# EasyEDA schematic DarkDetector.json
TITLE: Sheet_1; REV: 1.0; Date: 2025-12-07; Sheet: 1/1; Company: Your Company
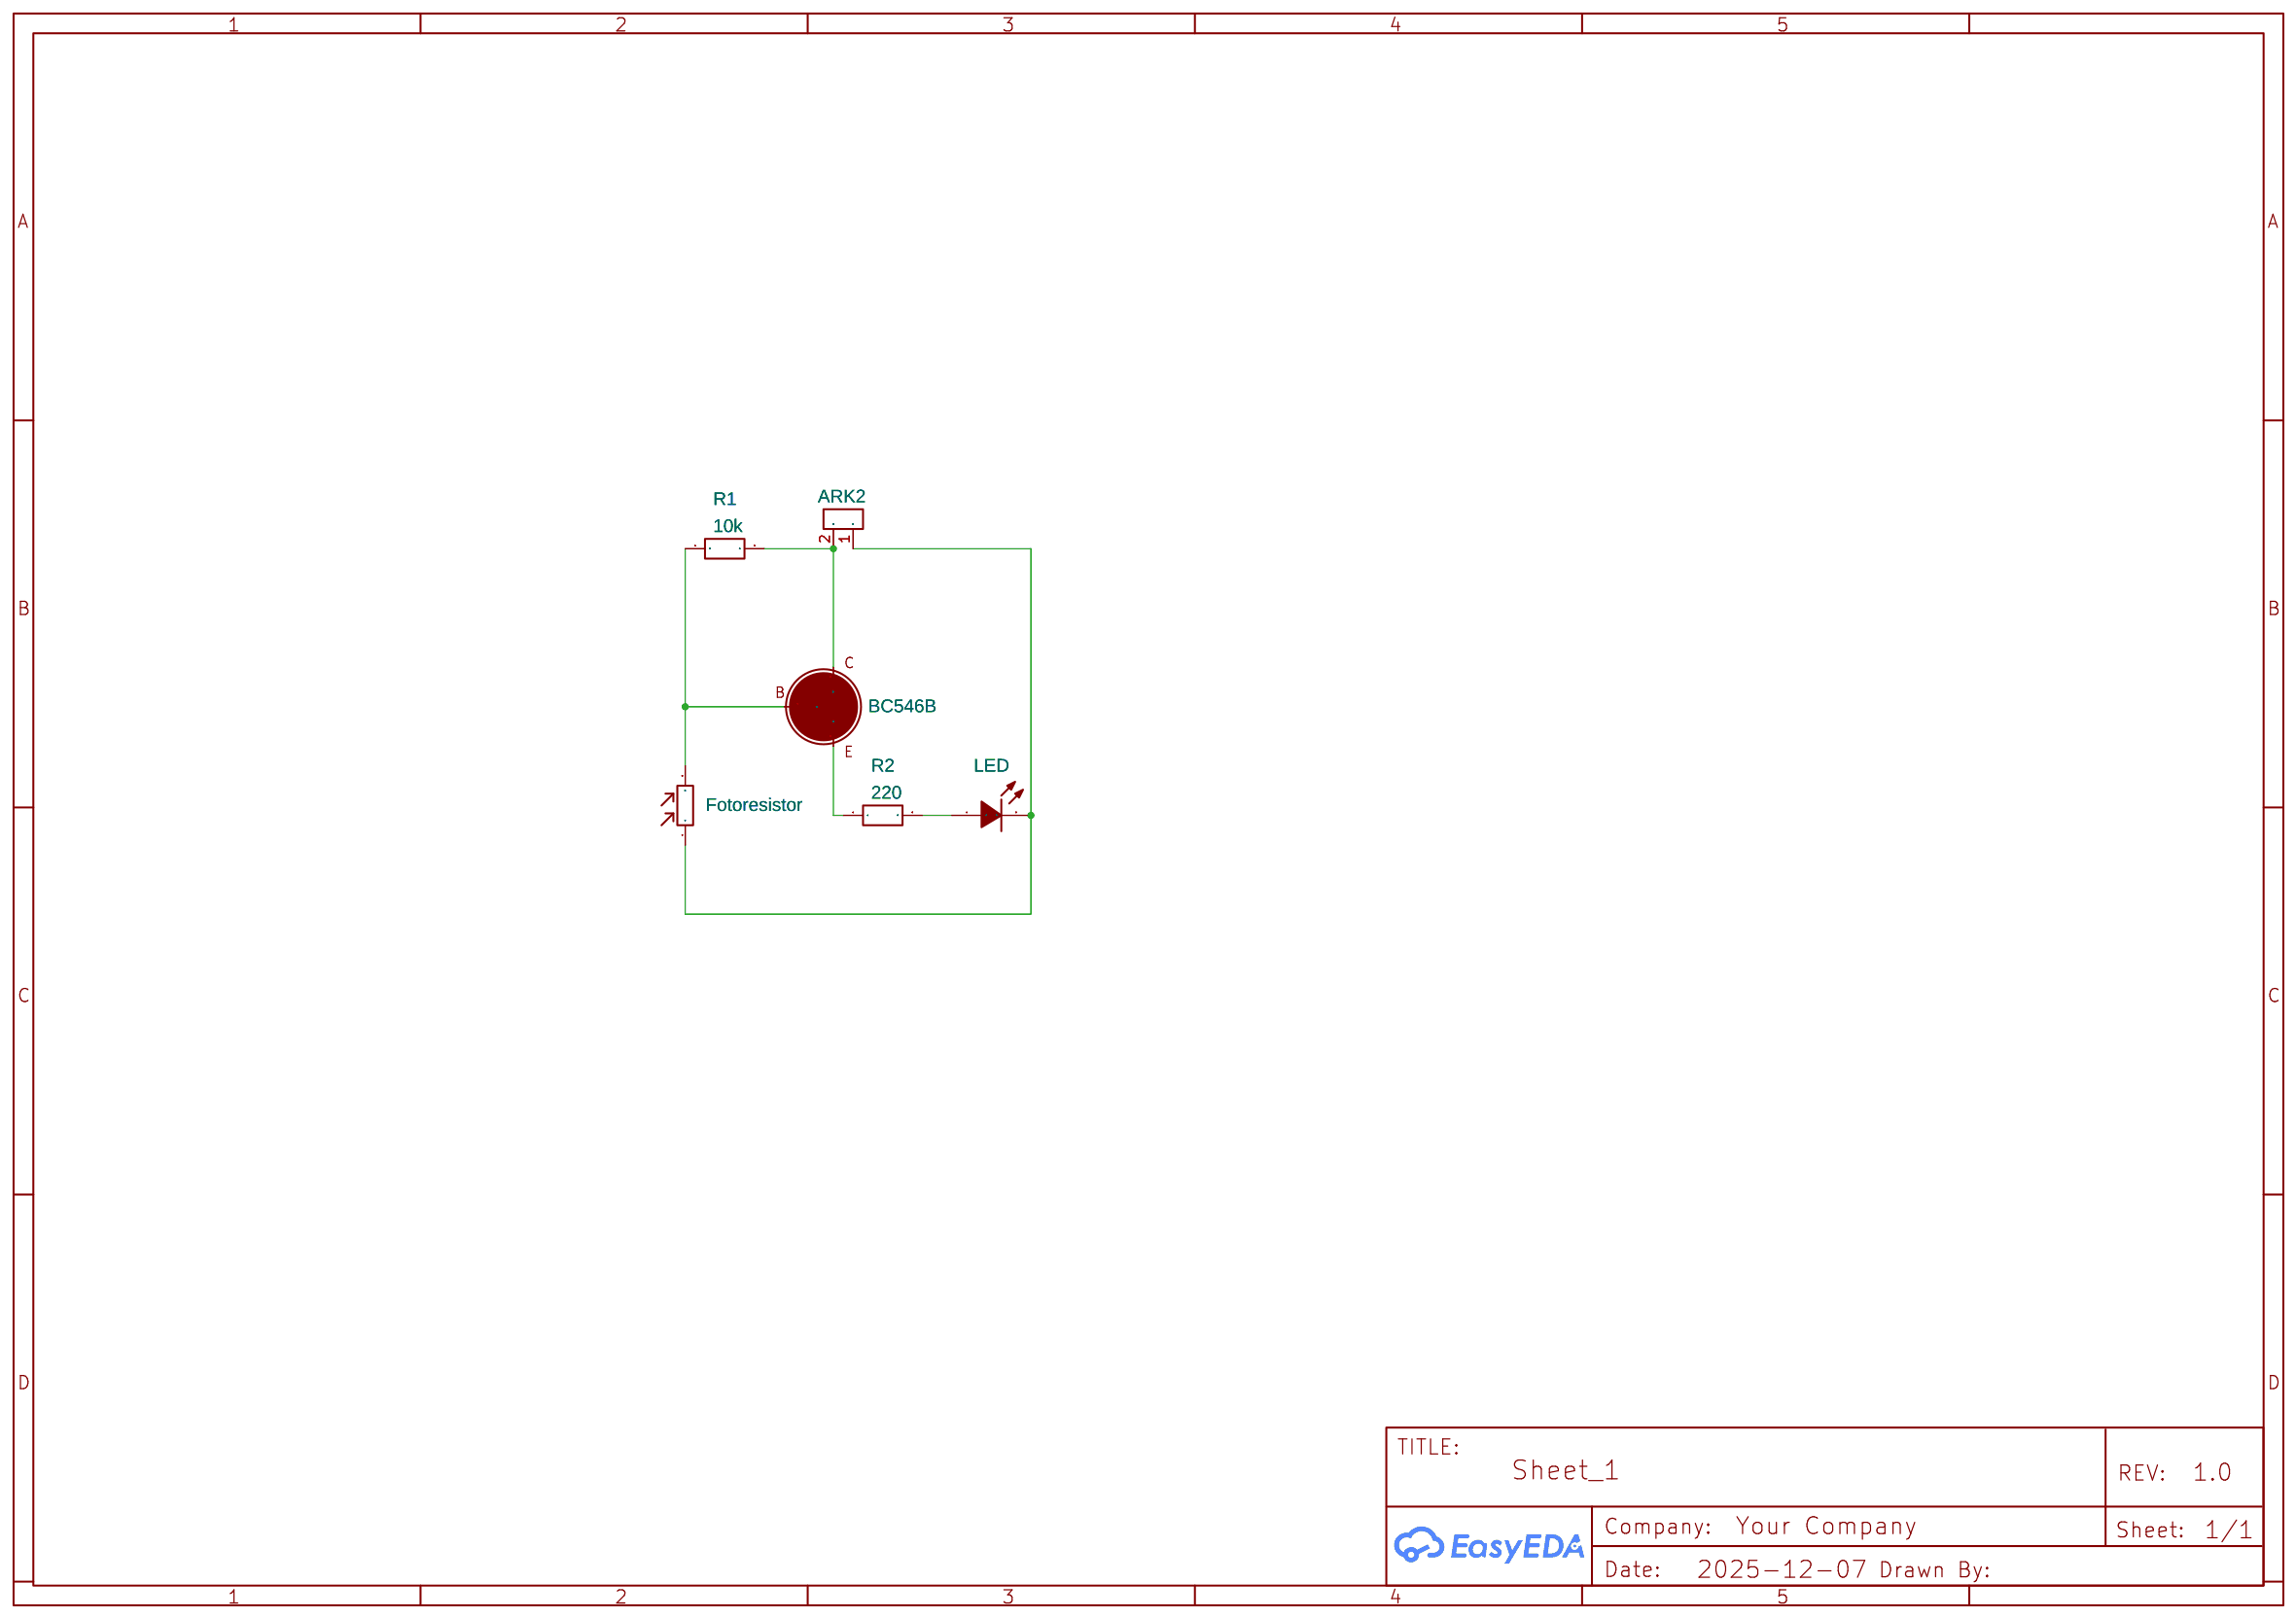
[diagram p0: schematic sheet]

## Parts
CON1  ARK2  [ARK2]
LED  RED  [LED]
Q1  BC546B  [BC546B]
R1  10k  [R-THT0207-10]
R2  220  [R-THT0207-10]
U1  Fotoresistor  [FOTORESISTOR]

## Library data of the parts
CON1 = ARK2: Contributor: Adamski
LED = LED-0603_R: Manufacturer: EVERLIGHT(台湾亿光); Manufacturer Part: 19-217/R6C-AL1M2VY/3T; Supplier Part: C72044; Supplier: LCSC; Contributor: LCEDA_01
Q1 = BC546B: Supplier Part: C154963; Supplier: LCSC; Manufacturer: CJ; Manufacturer Part: BC337; Contributor: novaelectronics; LCSC Assembly: Yes; SMT Type: Extend; Assembly Type: manualWeld; Paste Type: expand
R1 = R_0603_EU: Contributor: LCEDA_Lib; Package Display: No
R2 = R_0603_EU: Contributor: LCEDA_Lib
U1 = Fotoresistor G: Contributor: ghitamarius300

## Nets
Net-(CON1-1): CON1.1 LED.2 U1.1
Net-(CON1-2): CON1.2 Q1.1(C) R1.2
Net-(LED-1): LED.1 R2.2
Net-(Q1-2): Q1.2(B) R1.1 U1.2
Net-(Q1-3): Q1.3(E) R2.1
